# EAGLE schematic beeshield (EAGLE 6.5.0)
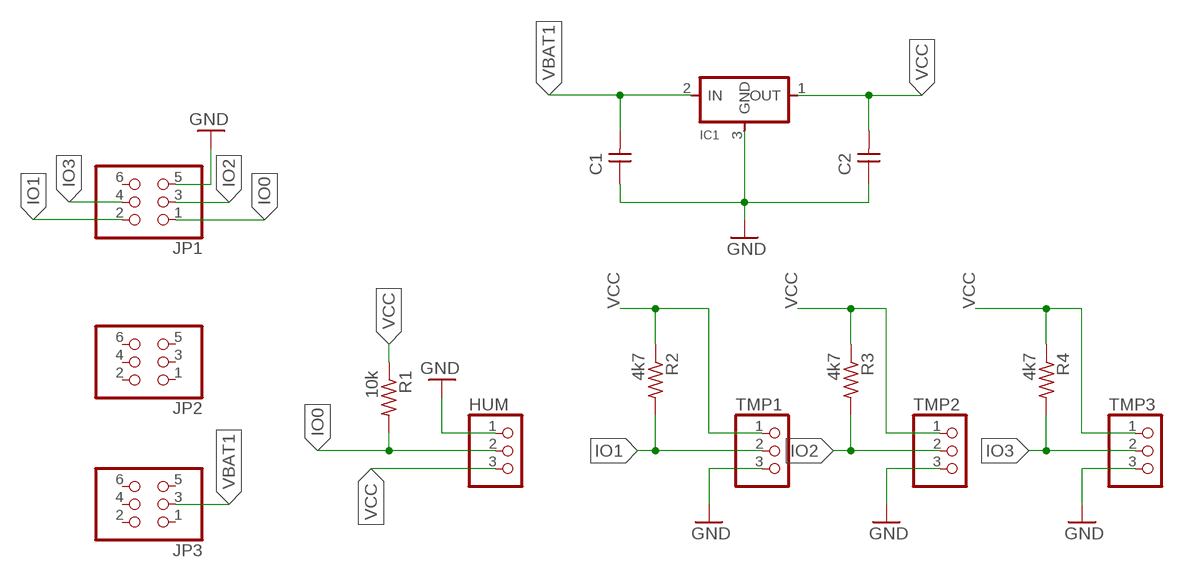
[diagram p0: schematic, sheet 1]

## Parts
C1  UNPOLARIZED_CAPACITOR1206  [1206]
C2  UNPOLARIZED_CAPACITOR1206  [1206]
HUM  PINHD-1X3  [1X03]
IC1  REGULATORSOT23  [SOT23]
JP1  PINHD-2X3-SMD  [2X03SMD]
JP2  PINHD-2X3-SMD  [2X03SMD]
JP3  PINHD-2X3-SMD  [2X03SMD]
R1  10k  RESISTOR1206  [1206]
R2  4k7  RESISTOR1206  [1206]
R3  4k7  RESISTOR1206  [1206]
R4  4k7  RESISTOR1206  [1206]
TMP1  PINHD-1X3  [1X03]
TMP2  PINHD-1X3  [1X03]
TMP3  PINHD-1X3  [1X03]

## Nets
GND: C1.1 C2.1 HUM.1 IC1.3(GND) JP1.5 TMP1.3 TMP2.3 TMP3.3
IO0: HUM.2 JP1.1 R1.2
IO1: JP1.2 R2.2 TMP1.2
IO2: JP1.3 R3.2 TMP2.2
IO3: JP1.4 R4.2 TMP3.2
VBAT1: C1.2 IC1.2(IN) JP3.3
VCC: C2.2 HUM.3 IC1.1(OUT) R1.1 R2.1 R3.1 R4.1 TMP1.1 TMP2.1 TMP3.1
Unconnected: JP1.6 JP2.1 JP2.2 JP2.3 JP2.4 JP2.5 JP2.6 JP3.1 JP3.2 JP3.4 JP3.5 JP3.6

## Library data of the parts
C1 C2 = FAB_Hello:UNPOLARIZED_CAPACITOR: unpolarized_capacitor
HUM TMP1-TMP3 = pinhead:PINHD-1X3: PIN HEADER
IC1 = fab:REGULATOR
JP1-JP3 = fab:PINHD-2X3-SMD: PIN HEADER
R1-R4 = FAB_Hello:RESISTOR